# EAGLE design transonlyfront (EAGLE 9.5.0)
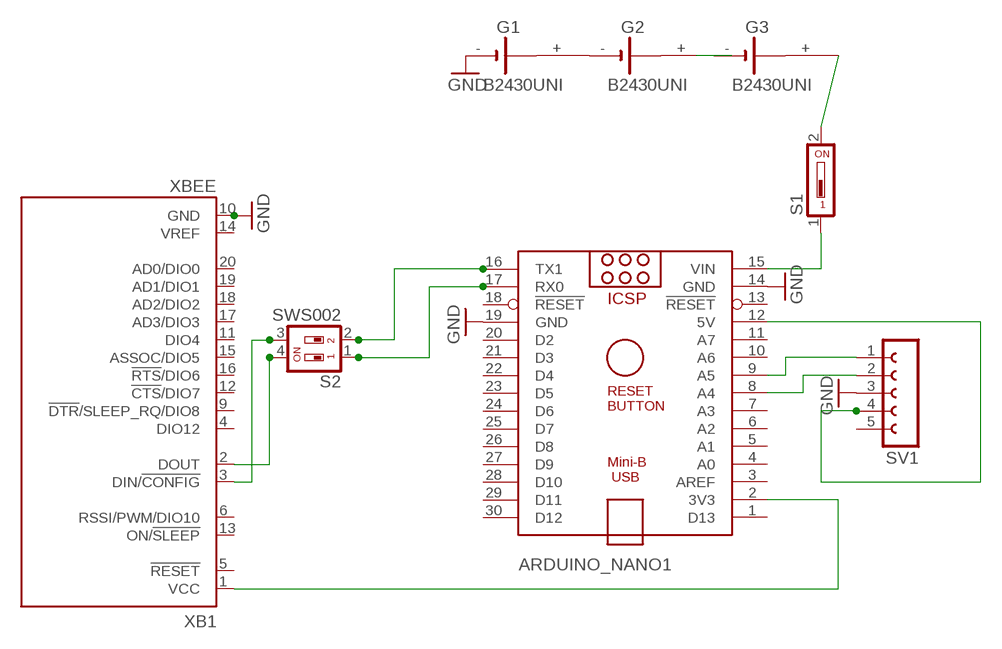
[diagram p0: schematic, sheet 1]

## Parts
ARDUINO_NANO1  ARDUINO_NANO  [ARDUINO_NANO]
G1  B2430UNI  [B2430UNI]
G2  B2430UNI  [B2430UNI]
G3  B2430UNI  [B2430UNI]
S1  DS01  [DS-01]
S2  SWS002  [SMS-002]
SV1  FE05-1  [FE05-1]
XB1  XBEE  [XBEE]

## Nets
GND: ARDUINO_NANO1.14(GND) ARDUINO_NANO1.19(GND) G1.- SV1.3 XB1.10(GND)
N$1: G1.+ G2.-
N$2: G2.+@1(+) G3.-
N$3: G2.+ G3.-@1(-)
N$5: G3.+ S1.2
N$6: ARDUINO_NANO1.15(VIN) S1.1
N$7: S2.4 XB1.2(DOUT)
N$8: ARDUINO_NANO1.17(RX0) S2.1
N$9: ARDUINO_NANO1.16(TX1) S2.2
N$10: S2.3 XB1.3(DIN/!CONFIG)
N$11: ARDUINO_NANO1.2(3V3) XB1.1(VCC)
N$12: ARDUINO_NANO1.9(A5) SV1.1
N$13: ARDUINO_NANO1.8(A4) SV1.2
N$14: ARDUINO_NANO1.12(5V) SV1.4
Unconnected: ARDUINO_NANO1.1(D13) ARDUINO_NANO1.3(AREF) ARDUINO_NANO1.4(A0) ARDUINO_NANO1.5(A1) ARDUINO_NANO1.6(A2) ARDUINO_NANO1.7(A3) ARDUINO_NANO1.10(A6) ARDUINO_NANO1.11(A7) ARDUINO_NANO1.13(!RESET) ARDUINO_NANO1.18(!RESET) ARDUINO_NANO1.20(D2) ARDUINO_NANO1.21(D3) ARDUINO_NANO1.22(D4) ARDUINO_NANO1.23(D5) ARDUINO_NANO1.24(D6) ARDUINO_NANO1.25(D7) ARDUINO_NANO1.26(D8) ARDUINO_NANO1.27(D9) ARDUINO_NANO1.28(D10) ARDUINO_NANO1.29(D11) ARDUINO_NANO1.30(D12) G1.+@1(+) G1.+@2(+) G1.+@3(+) G1.+@4(+) G1.-@1(-) G2.+@2(+) G2.+@3(+) G2.+@4(+) G2.-@1(-) G3.+@1(+) G3.+@2(+) G3.+@3(+) G3.+@4(+) SV1.5 XB1.4(DIO12) XB1.5(!RESET) XB1.6(RSSI/PWM/DIO10) XB1.9(!DTR!/SLEEP_RQ/DIO8) XB1.11(DIO4) XB1.12(!CTS!/DIO7) XB1.13(ON/!SLEEP) XB1.14(VREF) XB1.15(ASSOC/DIO5) XB1.16(!RTS!/DIO6) XB1.17(AD3/DIO3) XB1.18(AD2/DIO2) XB1.19(AD1/DIO1) XB1.20(AD0/DIO0)

## Library data of the parts
ARDUINO_NANO1 = ArduinoNanoV30:ARDUINO_NANO: Arduino Nano V3.0 Overview: The Arduino Nano is a small, complete, and breadboard-friendly board based on the ATmega328 (Arduino Nano 3.x) or ATmega168 (Arduino Nano 2.x). It has more or less the same functionality of the Arduino Duemilanove, but in a different package. It lacks only a DC power jack, and works with a Mini-B USB cable instead of a standard one. The Nano was designed and is being produced by Gravitech. Specifications: Microcontroller Atmel ATmega168 or ATmega328 Operating Voltage (logic level) 5 V Input Voltage (recommended) 7-12 V Input Voltage (limits) 6-20 V Digital I/O Pins 14 (of which 6 provide PWM output) Analog Input Pins 8 DC Current per I/O Pin 40 mA Flash Memory 16 KB (ATmega168) or 32 KB (ATmega328) of which 2 KB used by bootloader SRAM 1 KB (ATmega168) or 2 KB (ATmega328) EEPROM 512 bytes (ATmega168) or 1 KB (ATmega328) Clock Speed 16 MHz Dimensions 0.73" x 1.70" Length 45 mm Width 18 mm Weigth 5 g Power: The Arduino Nano can be powered via the Mini-B USB connection, 6-20V unregulated external power supply (pin 30), or 5V regulated external power supply (pin 27). The power source is automatically selected to the highest voltage source. Memory: The ATmega168 has 16 KB of flash memory for storing code (of which 2 KB is used for the bootloader); the ATmega328 has 32 KB, (also with 2 KB used for the bootloader). The ATmega168 has 1 KB of SRAM and 512 bytes of EEPROM (which can be read and written with the EEPROM library); the ATmega328 has 2 KB of SRAM and 1 KB of EEPROM. Input and Output: Each of the 14 digital pins on the Nano can be used as an input or output, using pinMode(), digitalWrite(), and digitalRead() functions. They operate at 5 volts. Each pin can provide or receive a maximum of 40 mA and has an internal pull-up resistor (disconnected by default) of 20-50 kOhms. In addition, some pins have specialized functions. Visit Arduino - ArduinoBoardNano <https://www.arduino.cc/en/Main/ArduinoBoardNano>
G1-G3 = battery:B2430UNI: LI BATTERY
S1 = switch-dil:DS01: DIL/CODE SWITCH; OC_FARNELL: unknown; OC_NEWARK: unknown
S2 = smd-special:SWS002: SMD Dip Switch 2 pol.
SV1 = con-lsta:FE05-1: FEMALE HEADER; OC_FARNELL: unknown; OC_NEWARK: unknown
XB1 = xbee:XBEE: XBee (TM) /XBee-PRO(TM) OEM RF Modules Source: MaxStream, Inc. xbee_productmanual.pdf; MPN: XBP24-Z7UIT-004; OC_FARNELL: 1751799; OC_NEWARK: 34R5507

## Board
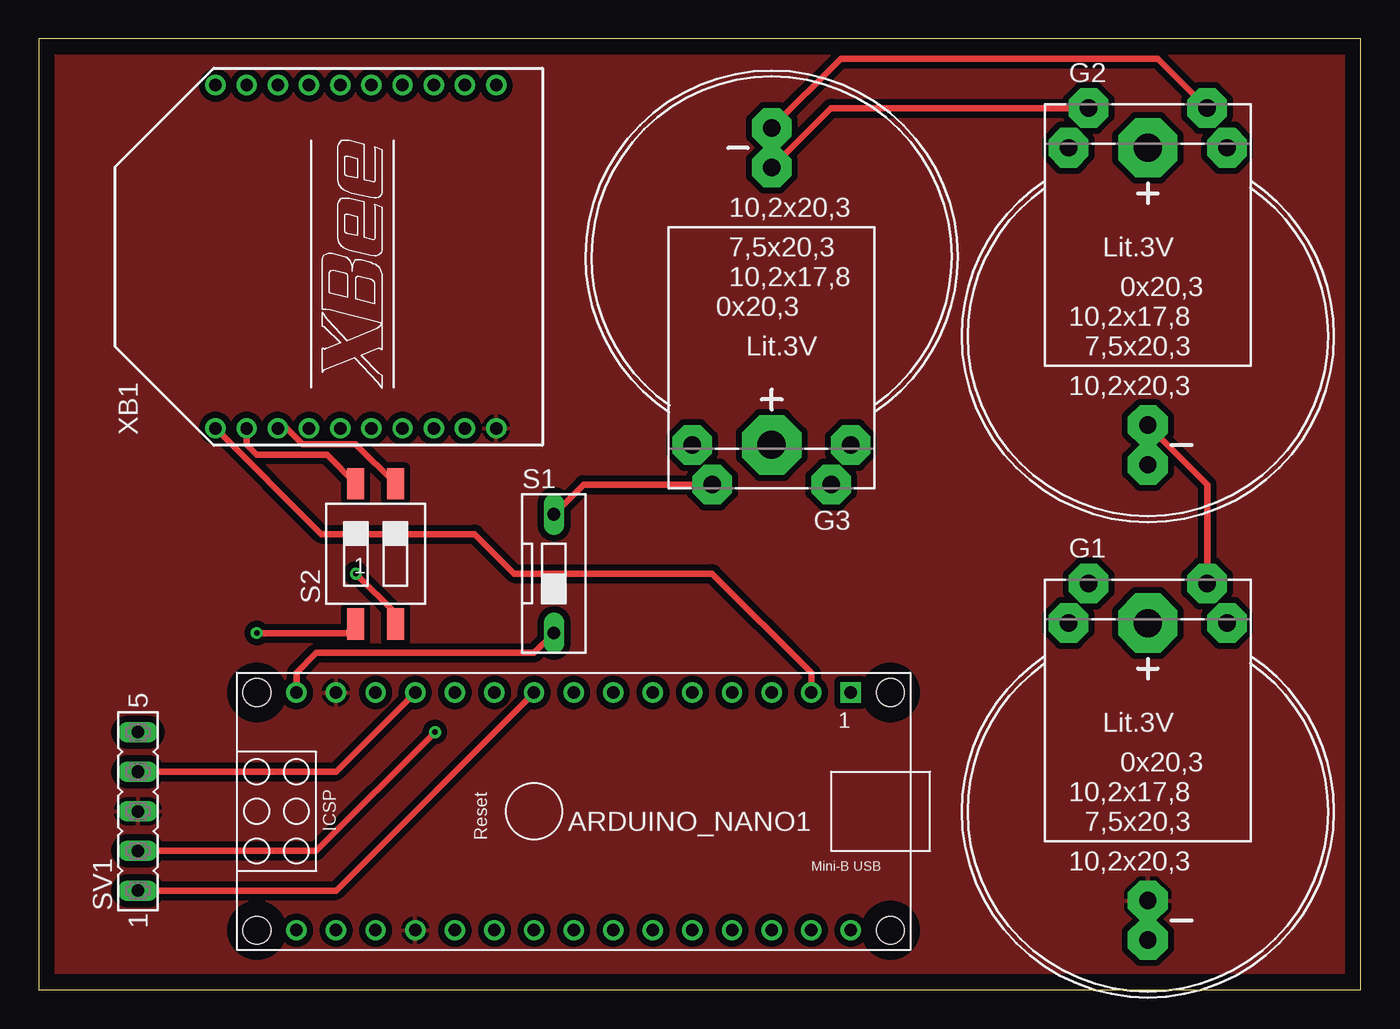
[diagram p1: board, top side]
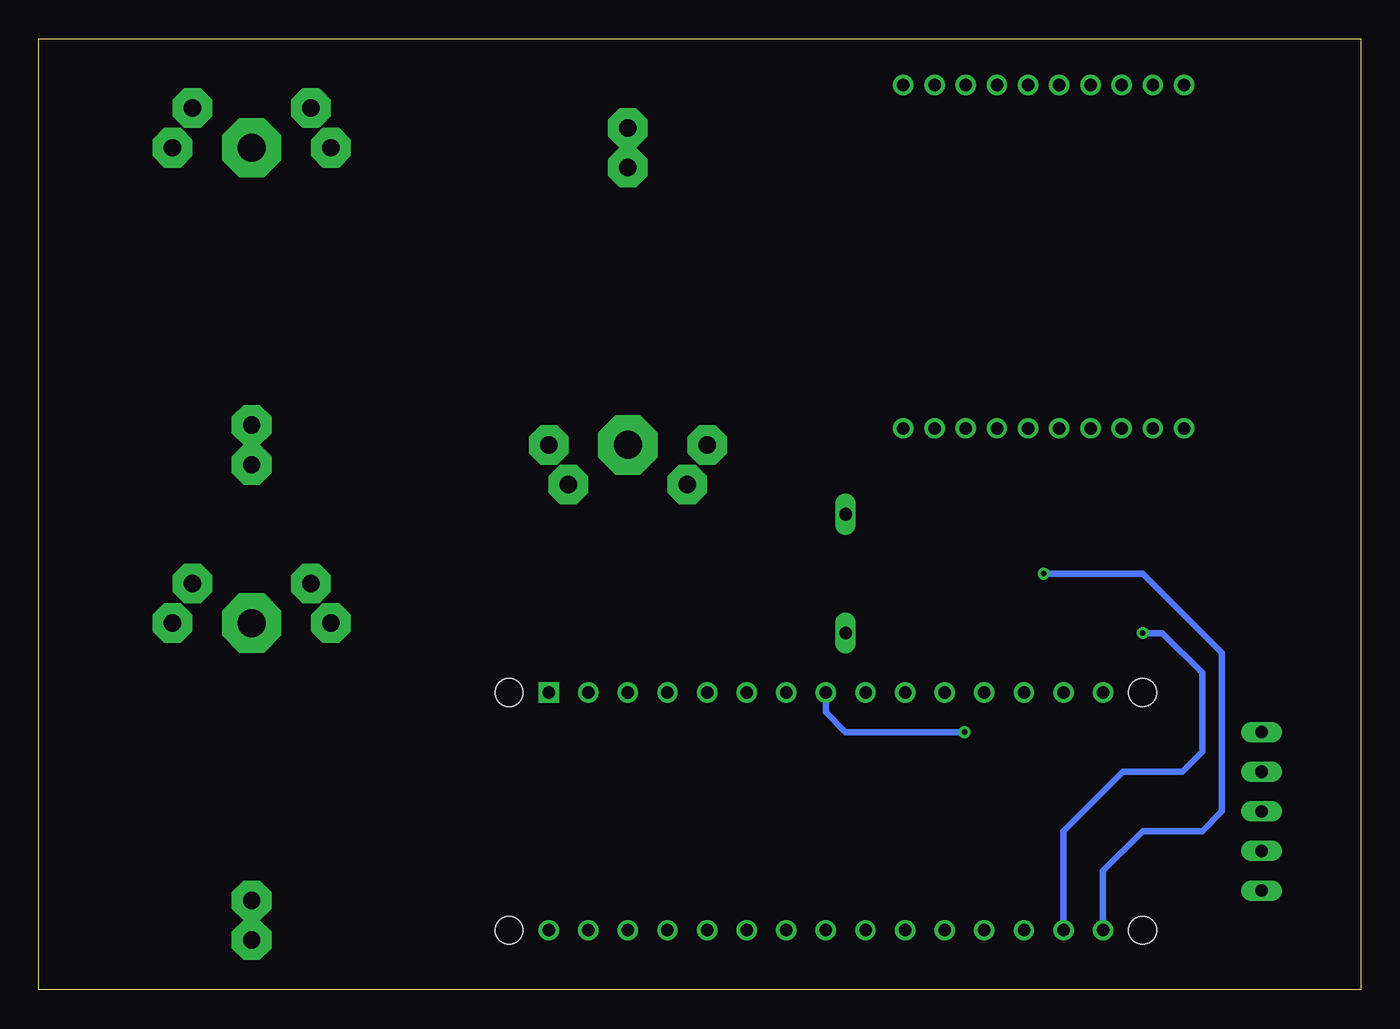
[diagram p2: board, bottom side, seen from below]

Size 84.76 x 60.95 mm. Coordinates in mm from the lower left corner, seen from the top.
Outline: 0,0 84.76,0 84.76,60.95 0,60.95 0,0
Copper layers (1*16): Top 0.035mm / dielectric 1.5mm / Bottom 0.035mm
Design rules "default": minimum track width 6mil, minimum drill 0.35mm, track to track 6mil, track to pad 6mil, pad to pad 6mil, via to via 6mil, smd to smd 6mil, copper to edge 40mil, drill to drill 6mil, minimum pad ring 10mil, minimum via ring 8mil, stop-mask expansion 4mil, vias tented up to drill 0mil, thermal gap 10mil

### Footprints (pad centres in the part's own frame; a part is rotated, then mirrored left to right if it is on the bottom)
ARDUINO_NANO = drill 0.8 square: 1 -20.32,-7.62 | drill 0.8: 2 -17.78,-7.62; 3 -15.24,-7.62; 4 -12.7,-7.62; 5 -10.16,-7.62; 6 -7.62,-7.62; 7 -5.08,-7.62; 8 -2.54,-7.62; 9 0,-7.62; 10 2.54,-7.62; 11 5.08,-7.62; 12 7.62,-7.62; 13 10.16,-7.62; 14 12.7,-7.62; 15 15.24,-7.62; 16 15.24,7.62; 17 12.7,7.62; 18 10.16,7.62; 19 7.62,7.62; 20 5.08,7.62; 21 2.54,7.62; 22 0,7.62; 23 -2.54,7.62; 24 -5.08,7.62; 25 -7.62,7.62; 26 -10.16,7.62; 27 -12.7,7.62; 28 -15.24,7.62; 29 -17.78,7.62; 30 -20.32,7.62 | hole 1.778: -22.86,-7.62; -22.86,7.62; 17.78,7.62; 17.78,-7.62
B2430UNI = drill 1.118 pad 2.54 octagon: + 3.81,14.605; +@1 -3.81,14.605; +@2 -5.08,12.065; +@3 5.08,12.065; - 0,-5.715; -@1 0,-8.255 | drill 1.803 pad 3.81 octagon: +@4 0,12.065
DS-01 = drill 0.813 long: 1 0,-3.81; 2 0,3.81
SMS-002 = smd 1.092 x 2.007: 1 -1.27,-4.496; 2 1.27,-4.496; 3 1.27,4.496; 4 -1.27,4.496
FE05-1 = drill 0.813 long: 1 -5.08,0; 2 -2.54,0; 3 0,0; 4 2.54,0; 5 5.08,0
XBEE = drill 0.8 pad 1.27: 1 -11,9; 2 -11,7; 3 -11,5; 4 -11,3; 5 -11,1; 6 -11,-1; 7 -11,-3; 8 -11,-5; 9 -11,-7; 10 -11,-9; 11 11,-9; 12 11,-7; 13 11,-5; 14 11,-3; 15 11,-1; 16 11,1; 17 11,3; 18 11,5; 19 11,7; 20 11,9

### Placement (x,y rotation side)
ARDUINO_NANO1  31.75,11.43 180 top
G1  71.12,11.43 0 top
G2  71.12,41.91 0 top
G3  46.99,46.99 180 top
S1  33.02,26.67 0 top
S2  21.59,27.94 0 top
SV1  6.35,11.43 90 top
XB1  20.32,46.99 90 top

### Tracks (layer width: path | path; a pad name or v marks a point on that pad's centre or on a via)
GND
  pour Top (isolate 0.406): 0,0 0,60.96 85.09,60.96 85.09,0
N$1
  Top 0.406: G1.+ 74.93,32.39 G2.-
N$2
  Top 0.406: G3.- 50.8,56.52 G2.+@1
N$3
  Top 0.406: G3.-@1 51.43,59.69 71.76,59.69 G2.+
N$5
  Top 0.406: S1.2 34.92,32.39 G3.+
N$6
  Top 0.406: ARDUINO_NANO1.15 16.51,20.32 17.78,21.59 31.75,21.59 S1.1
N$7
  Top 0.406: S2.4 18.47,34.29 13.97,34.29 13.32,34.94 XB1.2
N$8  (via drill 0.35)
  Top 0.406: v13.97,22.86 19.74,22.86 S2.1
  Bottom 0.406: ARDUINO_NANO1.17 19.05,10.16 15.24,13.97 11.43,13.97 10.16,15.24 10.16,20.32 12.7,22.86 v13.97,22.86
N$9  (via drill 0.35)
  Top 0.406: v20.32,26.67 22.86,24.13 S2.2
  Bottom 0.406: ARDUINO_NANO1.16 16.51,7.62 13.97,10.16 10.16,10.16 8.89,11.43 8.89,21.59 13.97,26.67 v20.32,26.67
  other vias: 16.51,3.81
N$10
  Top 0.406: S2.3 20.31,34.98 16.9,34.98 15.89,35.99 XB1.3
N$11
  Top 0.406: XB1.1 18.1,29.21 27.94,29.21 30.48,26.67 43.18,26.67 49.53,20.32 ARDUINO_NANO1.2
N$12
  Top 0.406: SV1.1 19.05,6.35 ARDUINO_NANO1.9
N$13  (via drill 0.35)
  Top 0.406: SV1.2 17.78,8.89 v25.4,16.51
  Bottom 0.406: v25.4,16.51 33.02,16.51 34.29,17.78 ARDUINO_NANO1.8
N$14
  Top 0.406: SV1.4 19.05,13.97 ARDUINO_NANO1.12